# Altium schematic sheet 00_Overview.SchDoc
size A3; SheetNumber: 1; SheetTotal: 11
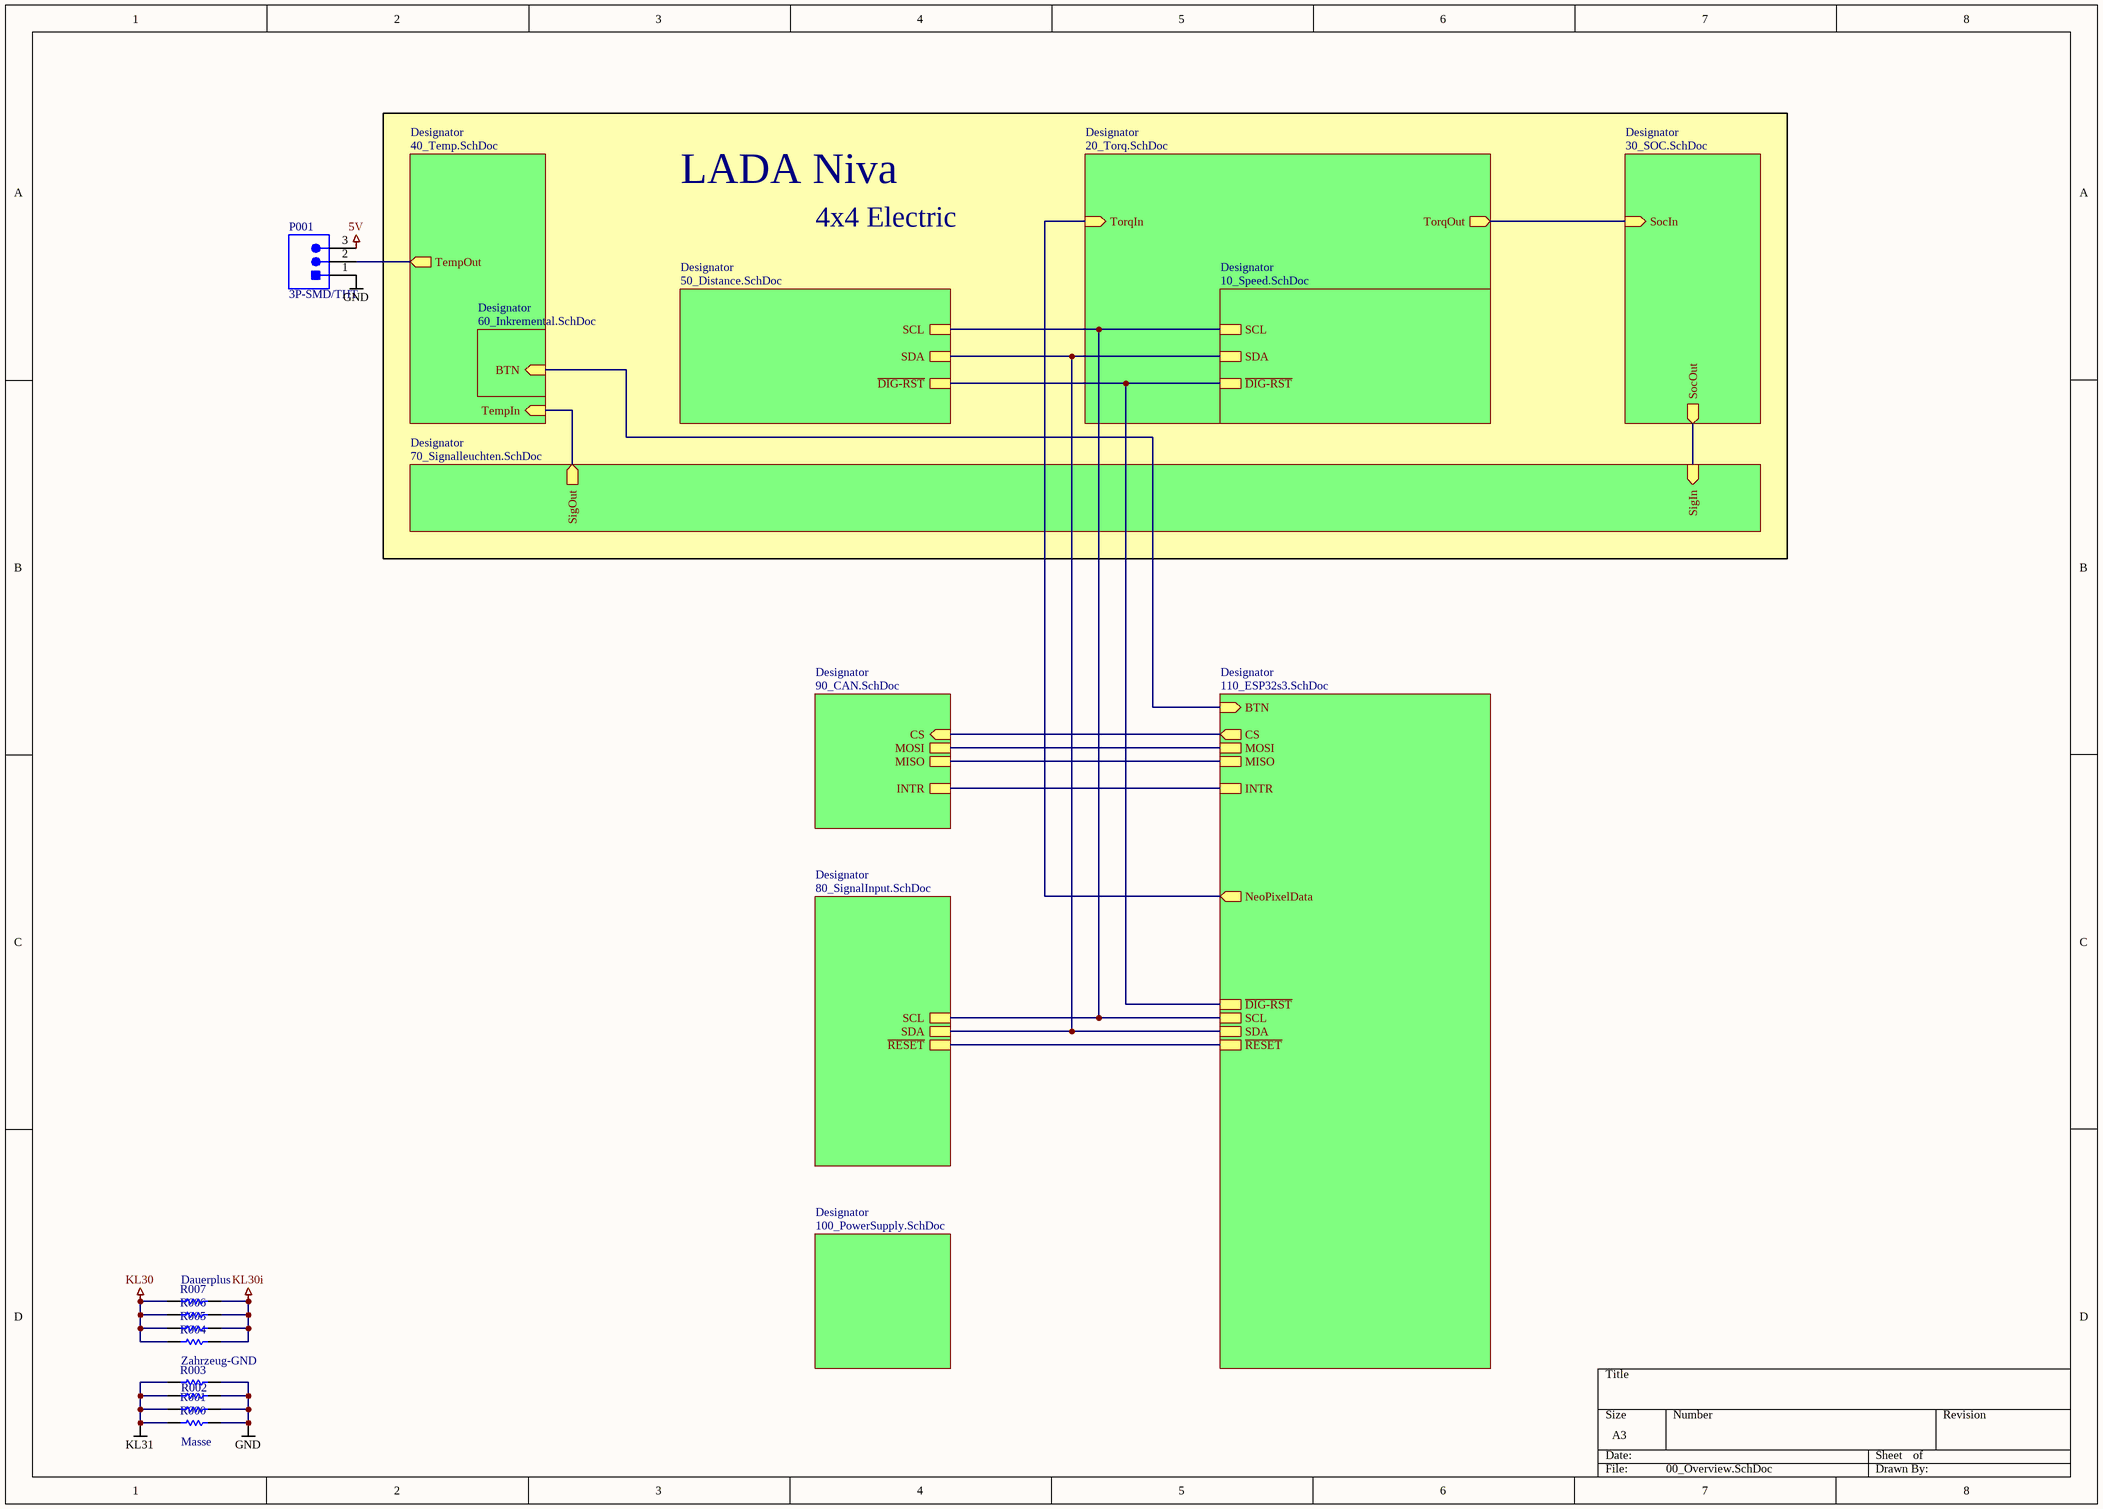
[diagram p0: 00_Overview.SchDoc]

## Parts
P001  3P-SMD/THT  [3P-SMD/THT]
R000  RC0603JR-070RL  [RESC1608X55X25ML10T15]  (value not drawn)
R001  RC0603JR-070RL  [RESC1608X55X25ML10T15]  (value not drawn)
R002  RC0603JR-070RL  [RESC1608X55X25ML10T15]  (value not drawn)
R003  RC0603JR-070RL  [RESC1608X55X25ML10T15]  (value not drawn)
R004  RC0603JR-070RL  [RESC1608X55X25ML10T15]  (value not drawn)
R005  RC0603JR-070RL  [RESC1608X55X25ML10T15]  (value not drawn)
R006  RC0603JR-070RL  [RESC1608X55X25ML10T15]  (value not drawn)
R007  RC0603JR-070RL  [RESC1608X55X25ML10T15]  (value not drawn)

## Sub-sheets
Designator = 110_ESP32s3.SchDoc: CS (out), INTR, MOSI, MISO, SCL, SDA, ~{RESET}, NeoPixelData (out), ~{DIG-RST}, BTN (in)
Designator = 20_Torq.SchDoc: TorqIn (in), TorqOut (out)
Designator = 10_Speed.SchDoc: SCL, SDA, ~{DIG-RST}
Designator = 30_SOC.SchDoc: SocIn (in), SocOut (out)
Designator = 40_Temp.SchDoc: TempOut (out), TempIn (in)
Designator = 70_Signalleuchten.SchDoc: SigIn (in), SigOut (out)
Designator = 50_Distance.SchDoc: SCL, SDA, ~{DIG-RST}
Designator = 60_Inkremental.SchDoc: BTN (in)
Designator = 80_SignalInput.SchDoc: SCL, SDA, ~{RESET}
Designator = 100_PowerSupply.SchDoc: no entries
Designator = 90_CAN.SchDoc: CS (in), INTR, MOSI, MISO

## Nets
5V: P001.3
GND: P001.1 R000.2 R001.2 R002.2 R003.2
KL30: R004.1 R005.1 R006.1 R007.1
KL30i: R004.2 R005.2 R006.2 R007.2
KL31: R000.1 R001.1 R002.1 R003.1
NetP001_2: P001.2 ; sheet Designator/TempOut
(unnamed): sheet Designator/CS, sheet Designator/CS
(unnamed): sheet Designator/INTR, sheet Designator/INTR
(unnamed): sheet Designator/MOSI, sheet Designator/MOSI
(unnamed): sheet Designator/MISO, sheet Designator/MISO
(unnamed): sheet Designator/SCL, sheet Designator/SCL, sheet Designator/SCL, sheet Designator/SCL
(unnamed): sheet Designator/SDA, sheet Designator/SDA, sheet Designator/SDA, sheet Designator/SDA
(unnamed): sheet Designator/~{RESET}, sheet Designator/~{RESET}
(unnamed): sheet Designator/NeoPixelData, sheet Designator/TorqIn
(unnamed): sheet Designator/~{DIG-RST}, sheet Designator/~{DIG-RST}, sheet Designator/~{DIG-RST}
(unnamed): sheet Designator/BTN, sheet Designator/BTN
(unnamed): sheet Designator/TorqOut, sheet Designator/SocIn
(unnamed): sheet Designator/SocOut, sheet Designator/SigIn
(unnamed): sheet Designator/TempIn, sheet Designator/SigOut

## Notes on the sheet
- LADA Niva
- 4x4 Electric
- (near R007) Dauerplus
- Zahrzeug-GND
- (near R000) Masse

## Library data of the parts
R000 R001 R002 R003 R004 R005 R006 R007 = CMP-2100-03667-1: Chip Resistor, 0 Ohm, +/- 5%, 0.1 W, -55 to 155 degC, 0603 (1608 Metric), RoHS, Tape and Reel; Manufacturer: Yageo; Temperature Coefficient: 200ppm/degreesC; Voltage Rating: 50V; Power Rating: 100mW; Resistance: 0mOhm; Width: 0.8mm; Max Operating Temperature: 155degC; Tolerance: 5%; Package Reference: 0603; Height: 0.45mm; Depth: 0.8mm; Package Description: 2-Pin Surface Mount Device, Body 1.6 x 0.8 mm; Termination: SMD/SMT; Package Quantity: 5000; Case/Package: 0603; Case Code (Imperial): 0603; Radiation Hardening: No; Number of Pins: 2; Length: 1.6mm; Lead Free: LeadFree; Voltage Rating (DC): 50V; Military Standard: Not; Datasheet URL: http://www.yageo.com/NewPortal/yageodocoutput?fileName=/pdf/R-Chip/PYu-RC_Group_51_RoHS_L_5.pdf; Manufacturer URL: http://www.yageo.com/; Packaging: TapeandReel; Case Code (Metric): 1608; Min Operating Temperature: -55degC; Composition: ThickFilm; RoHSCompliant: true; Contact Plating: Tin; Datasheet Version: Rev. 5, 10/2016; REACH SVHC: NoSVHC